# Altium schematic sheet LINK.SchDoc
size A4; DocumentNumber: 4; SheetNumber: 4; SheetTotal: 15
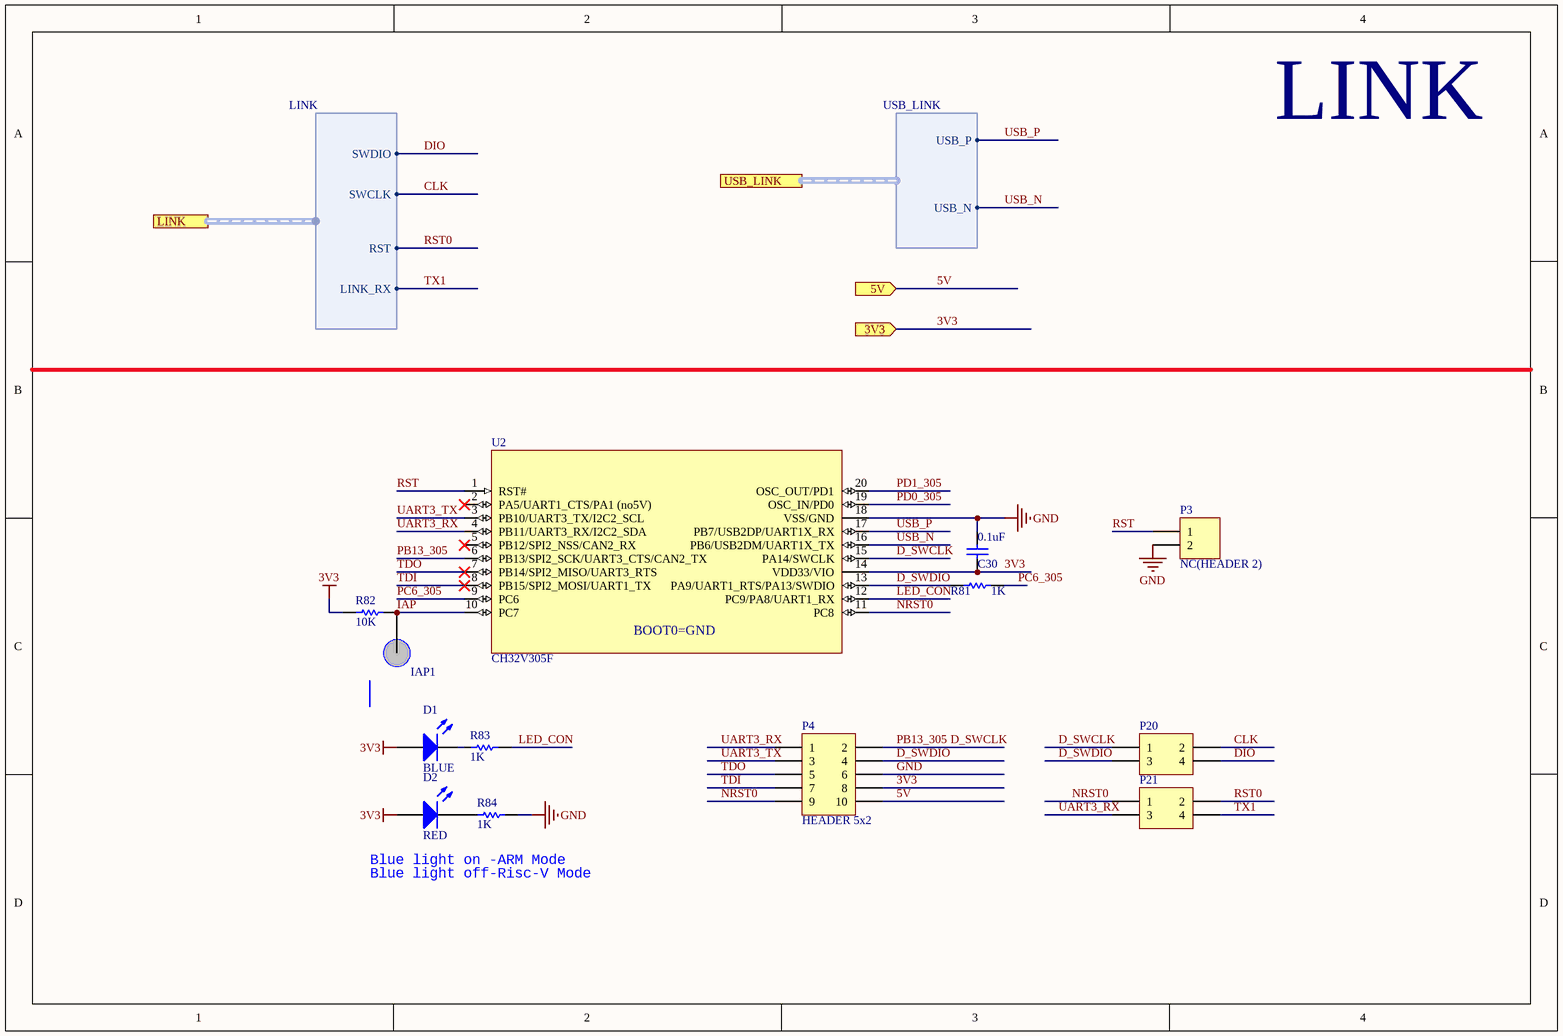
[diagram p0: LINK.SchDoc]

## Parts
C30  0.1uF  [0402_C]
D1  BLUE  [0603+]
D2  RED  [0603+]
IAP1  Testpoint  [TESTPOINT1]  (value not drawn)
P3  NC(HEADER 2)  [SIP2-2.54mm]
P4  HEADER 5x2  [IDC10-2.54mm]
P20  HEADER 2x2  [IDC4-2.54MM]  (value not drawn)
P21  HEADER 2x2  [IDC4-2.54MM]  (value not drawn)
R81  1K  [0402]
R82  10K  [0402]
R83  1K  [0402]
R84  1K  [0402]
U2  CH32V305F  [TSSOP20]

## Ports
3V3 (in), 5V (in), LINK (harness LINK), USB_LINK (harness USB_LINK)

## Harnesses
LINK: SWDIO, SWCLK, RST, LINK_RX
USB_LINK: USB_P, USB_N

## Nets
3V3: C30.1 D1.1(A) D2.1(A) P4.8 R82.2 U2.14(VDD33/VIO) ; port 3V3
GND: C30.2 P3.2 P4.6 R84.1 U2.18(VSS/GND)
5V: P4.10 ; port 5V
CLK: P20.2 ; port LINK.SWCLK
D_SWCLK: P4.2 P20.1 U2.6(PB13/SPI2_SCK/UART3_CTS/CAN2_TX) U2.15(PA14/SWCLK)  [also labelled PB13_305]
D_SWDIO: P4.4 P20.3 R81.1 U2.13(PA9/UART1_RTS/PA13/SWDIO)
DIO: P20.4 ; port LINK.SWDIO
IAP: IAP1.1(point) R82.1 U2.10(PC7)
LED_CON: R83.1 U2.12(PC9/PA8/UART1_RX)
NRST0: P4.9 P21.1 U2.11(PC8)
PC6_305: R81.2 U2.9(PC6)
PD0_305: U2.19(OSC_IN/PD0)
PD1_305: U2.20(OSC_OUT/PD1)
RST: P3.1 U2.1(RST#)
RST0: P21.2 ; port LINK.RST
TDI: P4.7 U2.8(PB15/SPI2_MOSI/UART1_TX)
TDO: P4.5 U2.7(PB14/SPI2_MISO/UART3_RTS)
TX1: P21.4 ; port LINK.LINK_RX
UART3_RX: P4.1 P21.3 U2.4(PB11/UART3_RX/I2C2_SDA)
UART3_TX: P4.3 U2.3(PB10/UART3_TX/I2C2_SCL)
USB_N: U2.16(PB6/USB2DM/UART1X_TX) ; port USB_LINK.USB_N
USB_P: U2.17(PB7/USB2DP/UART1X_RX) ; port USB_LINK.USB_P
NetD1_2: D1.2(K) R83.2
NetD2_2: D2.2(K) R84.2

Not connected (* = marked no-connect by the designer): U2 2(PA5/UART1_CTS/PA1_(no5V))* 5(PB12/SPI2_NSS/CAN2_RX)*

## Notes on the sheet
- LINK
- Blue light on -ARM Mode
- Blue light off-Risc-V Mode
- (in symbol CH32V305F) BOOT0=GND

## Library data of the parts
C30 = Cap: Capacitor
D1 D2 = D0603: Typical RED, GREEN, YELLOW, AMBER GaAs LED; Published: 8-Jun-2000; LatestRevisionDate: 17-Jul-2002; LatestRevisionNote: Re-released for DXP Platform.; PackageVersion: Feb-2002; PackageReference: 3.2X1.6X1.1; Publisher: Altium Limited; PackageDescription: SM LED; 2 Flat Leads
IAP1 = Testpoint: 测试点
P3 = HEADER 2: Header, 2-Pin
P4 = HEADER 5x2: Header, 5-Pin, Dual row
P20 P21 = HEADER 2x2: Header, 2-Pin, Dual row
R81-R84 = R0603: Resistor; Published: 8-Jun-2000; LatestRevisionDate: 17-Jul-2002; LatestRevisionNote: Re-released for DXP Platform.; PackageReference: AXIAL-0.3; Publisher: Altium Limited; PackageDescription: Axial Device, Thru-Hole; 2 Leads; 0.3 in Pin Spacing
U2 = CH32V305F: RISC-V FPU HD-MCU, 144MHz, USB_480M, CAN, UART*2, SPI